# EAGLE design lpc2148 (EAGLE 9.4.1)
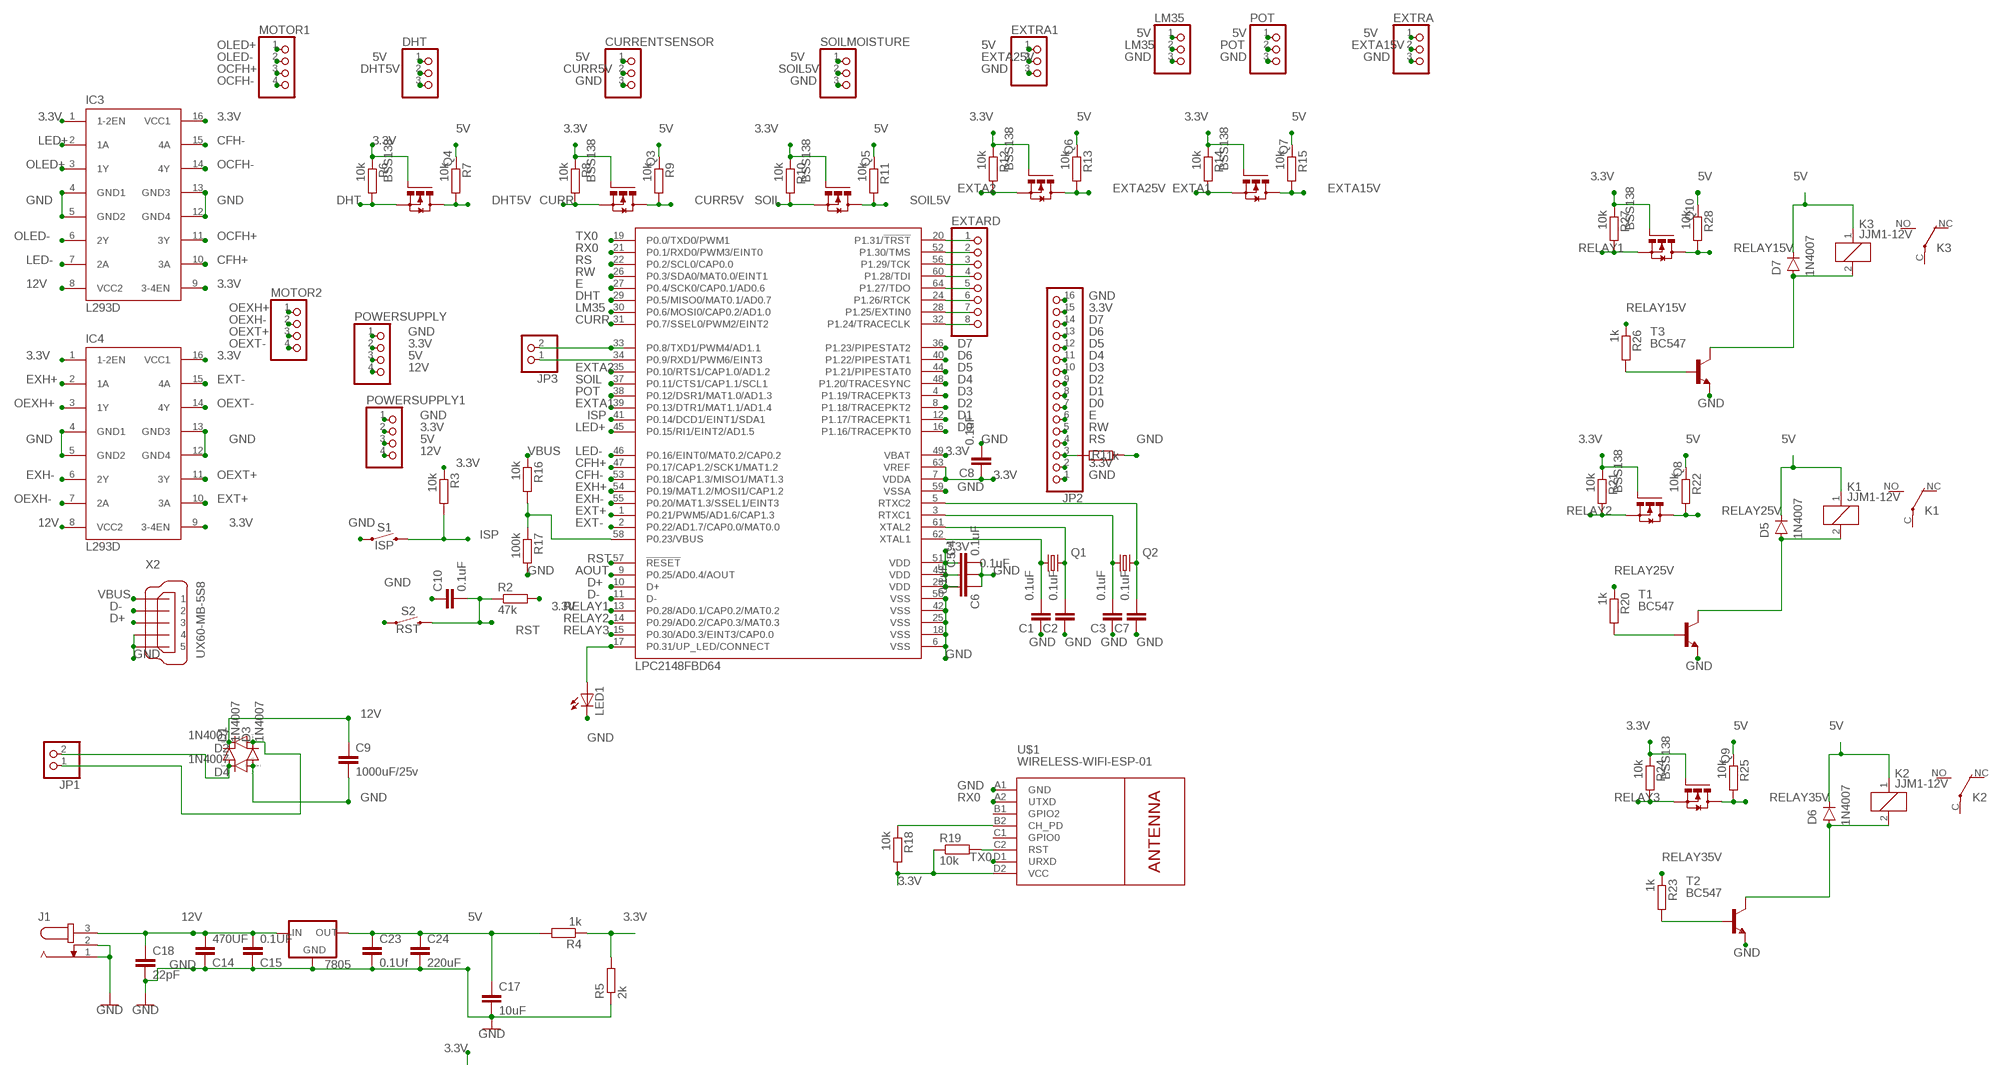
[diagram p0: schematic, sheet 1]

## Parts
7805  78XXL  [78XXL]
C1  0.1uF  10NF-0603-50V-10%  [0603]
C2  0.1uF  10NF-0603-50V-10%  [0603]
C3  0.1uF  10NF-0603-50V-10%  [0603]
C4  0.1uF  10NF-0603-50V-10%  [0603]
C5  0.1uF  10NF-0603-50V-10%  [0603]
C6  0.1uF  10NF-0603-50V-10%  [0603]
C7  0.1uF  10NF-0603-50V-10%  [0603]
C8  0.1uF  10NF-0603-50V-10%  [0603]
C9  1000uF/25v  22PF-0603-50V-5%  [0603]
C10  0.1uF  22PF-0603-50V-5%  [0603]
C14  470UF  22PF-0603-50V-5%  [0603]
C15  0.1UF  22PF-0603-50V-5%  [0603]
C17  10uF  22PF-0603-50V-5%  [0603]
C18  22pF  22PF-0603-50V-5%  [0603]
C23  0.1Uf  22PF-0603-50V-5%  [0603]
C24  220uF  22PF-0603-50V-5%  [0603]
CURRENTSENSOR  PINHD-1X3  [1X03]
D1  1N4007  1N4004  [DO41-10]
D2  1N4007  1N4004  [DO41-10]
D3  1N4007  1N4004  [DO41-10]
D4  1N4007  1N4004  [DO41-10]
D5  1N4007  [DO-41]
D6  1N4007  [DO-41]
D7  1N4007  [DO-41]
DHT  PINHD-1X3  [1X03]
EXTARD  PINHD-1X8-3.5MM  [1X08-3.5MM]
EXTRA  PINHD-1X3  [1X03]
EXTRA1  PINHD-1X3  [1X03]
IC3  L293D  [DIL16]
IC4  L293D  [DIL16]
J1  JACK-PLUG1  [SPC4078]
JP1  PINHD-1X2  [1X02]
JP2  PINHD-1X16  [1X16]
JP3  PINHD-1X2  [1X02]
K1  JJM1-12V  [JJM1C]
K2  JJM1-12V  [JJM1C]
K3  JJM1-12V  [JJM1C]
LED1  LED5MM  [LED5MM]
LM35  PINHD-1X3  [1X03]
MOTOR1  PINHD-1X4  [1X04]
MOTOR2  PINHD-1X4  [1X04]
POT  PINHD-1X3  [1X03]
POWERSUPPLY  PINHD-1X4  [1X04]
POWERSUPPLY1  PINHD-1X4  [1X04]
Q1  KX-12B  [6.0X3.5_2]
Q2  KX-12B  [6.0X3.5_2]
Q3  BSS138  [SOT23-3]
Q4  BSS138  [SOT23-3]
Q5  BSS138  [SOT23-3]
Q6  BSS138  [SOT23-3]
Q7  BSS138  [SOT23-3]
Q8  BSS138  [SOT23-3]
Q9  BSS138  [SOT23-3]
Q10  BSS138  [SOT23-3]
R1  1k  R-EU_0204/5  [0204/5]
R2  47k  R-EU_0204/5  [0204/5]
R3  10k  R-EU_0204/5  [0204/5]
R4  1k  R-EU_0204/5  [0204/5]
R5  2k  R-EU_0204/5  [0204/5]
R6  10k  R-EU_0204/5  [0204/5]
R7  10k  R-EU_0204/5  [0204/5]
R8  10k  R-EU_0204/5  [0204/5]
R9  10k  R-EU_0204/5  [0204/5]
R10  10k  R-EU_0204/5  [0204/5]
R11  10k  R-EU_0204/5  [0204/5]
R12  10k  R-EU_0204/5  [0204/5]
R13  10k  R-EU_0204/5  [0204/5]
R14  10k  R-EU_0204/5  [0204/5]
R15  10k  R-EU_0204/5  [0204/5]
R16  10k  R-EU_0204/5  [0204/5]
R17  100k  R-EU_0204/5  [0204/5]
R18  10k  R-EU_0204/5  [0204/5]
R19  10k  R-EU_0204/5  [0204/5]
R20  1k  R-EU_0204/5  [0204/5]
R21  10k  R-EU_0204/5  [0204/5]
R22  10k  R-EU_0204/5  [0204/5]
R23  1k  R-EU_0204/5  [0204/5]
R24  10k  R-EU_0204/5  [0204/5]
R25  10k  R-EU_0204/5  [0204/5]
R26  1k  R-EU_0204/5  [0204/5]
R27  10k  R-EU_0204/5  [0204/5]
R28  10k  R-EU_0204/5  [0204/5]
S1  ISP  MOMENTARY-SWITCH-SPST-PTH-6.0MM-KIT  [TACTILE_SWITCH_PTH_6.0MM_KIT]
S2  RST  MOMENTARY-SWITCH-SPST-PTH-6.0MM-KIT  [TACTILE_SWITCH_PTH_6.0MM_KIT]
SOILMOISTURE  PINHD-1X3  [1X03]
T1  BC547  [TO92]
T2  BC547  [TO92]
T3  BC547  [TO92]
U1  LPC2148FBD64  [TSQFP50P1200X1200X160-64N]
U$1  WIRELESS-WIFI-ESP-01  [WIRELESS-WIFI-ESP-01]
X2  UX60-MB-5S8  [UX60-MB-5S8]

## Nets
3.3V: C4.1 C5.1 C6.2 C8.1 IC3.1(1-2EN) IC3.9(3-4EN) IC3.16(VCC1) IC4.1(1-2EN) IC4.9(3-4EN) IC4.16(VCC1) JP2.2 JP2.15 POWERSUPPLY1.2 POWERSUPPLY.2 Q3.1(G) Q4.1(G) Q5.1(G) Q6.1(G) Q7.1(G) Q8.1(G) Q9.1(G) Q10.1(G) R2.2 R3.1 R4.1 R5.2 R6.1 R8.1 R10.1 R12.1 R14.1 R18.2 R19.1 R21.1 R24.1 R27.1 U1.7(VDDA) U1.23(VDD) U1.43(VDD) U1.49(VBAT) U1.51(VDD) U1.63(VREF) U$1.D2(VCC)
5V: 7805.OUT C17.1 C23.1 C24.1 CURRENTSENSOR.1 D5.C D6.C D7.C DHT.1 EXTRA1.1 EXTRA.1 K1.1 K2.1 K3.1 LM35.1 POT.1 POWERSUPPLY1.3 POWERSUPPLY.3 R4.2 R7.1 R9.1 R11.1 R13.1 R15.1 R22.1 R25.1 R28.1 SOILMOISTURE.1
12V: 7805.IN C9.1 C14.1 C15.1 C18.1 D1.C D2.C IC3.8(VCC2) IC4.8(VCC2) J1.3 POWERSUPPLY1.4 POWERSUPPLY.4
AOUT: U1.9(P0.25/AD0.4/AOUT)
CFH+: IC3.10(3A) U1.47(P0.17/CAP1.2/SCK1/MAT1.2)
CFH-: IC3.15(4A) U1.53(P0.18/CAP1.3/MISO1/MAT1.3)
CURR: Q3.2(S) R8.2 U1.31(P0.7/SSEL0/PWM2/EINT2)
CURR5V: CURRENTSENSOR.2 Q3.3(D) R9.2
D0: JP2.7 U1.16(P1.16/TRACEPKT0)
D1: JP2.8 U1.12(P1.17/TRACEPKT1)
D2: JP2.9 U1.8(P1.18/TRACEPKT2)
D3: JP2.10 U1.4(P1.19/TRACEPKT3)
D4: JP2.11 U1.48(P1.20/TRACESYNC)
D5: JP2.12 U1.44(P1.21/PIPESTAT0)
D6: JP2.13 U1.40(P1.22/PIPESTAT1)
D7: JP2.14 U1.36(P1.23/PIPESTAT2)
D+: U1.10(D+) X2.3
D-: U1.11(D-) X2.2
DHT: Q4.2(S) R6.2 U1.29(P0.5/MISO0/MAT0.1/AD0.7)
DHT5V: DHT.2 Q4.3(D) R7.2
E: JP2.6 U1.27(P0.4/SCK0/CAP0.1/AD0.6)
EXH+: IC4.2(1A) U1.54(P0.19/MAT1.2/MOSI1/CAP1.2)
EXH-: IC4.6(2Y) U1.55(P0.20/MAT1.3/SSEL1/EINT3)
EXT+: IC4.10(3A) U1.1(P0.21/PWM5/AD1.6/CAP1.3)
EXT-: IC4.15(4A) U1.2(P0.22/AD1.7/CAP0.0/MAT0.0)
EXTA1: Q7.2(S) R14.2 U1.39(P0.13/DTR1/MAT1.1/AD1.4)
EXTA2: Q6.2(S) R12.2 U1.35(P0.10/RTS1/CAP1.0/AD1.2)
EXTA15V: EXTRA.2 Q7.3(D) R15.2
EXTA25V: EXTRA1.2 Q6.3(D) R13.2
GND: 7805.GND C1.1 C2.1 C3.1 C4.2 C5.2 C6.1 C7.1 C8.2 C9.2 C10.1 C14.2 C15.2 C17.2 C18.2 C23.2 C24.2 CURRENTSENSOR.3 D3.A D4.A DHT.3 EXTRA1.3 EXTRA.3 IC3.4(GND1) IC3.5(GND2) IC3.12(GND4) IC3.13(GND3) IC4.4(GND1) IC4.5(GND2) IC4.12(GND4) IC4.13(GND3) J1.1 J1.2 JP2.1 JP2.16 LED1.K(C) LM35.3 POT.3 POWERSUPPLY1.1 POWERSUPPLY.1 R1.1 R5.1 R17.2 S1.1 SOILMOISTURE.3 T1.1(E) T2.1(E) T3.1(E) U1.6(VSS) U1.18(VSS) U1.25(VSS) U1.42(VSS) U1.50(VSS) U1.59(VSSA) U$1.A1(GND) X2.4 X2.5
ISP: R3.2 S1.3 U1.41(P0.14/DCD1/EINT1/SDA1)
LED+: IC3.2(1A) U1.45(P0.15/RI1/EINT2/AD1.5)
LED-: IC3.7(2A) U1.46(P0.16/EINT0/MAT0.2/CAP0.2)
LM35: LM35.2 U1.30(P0.6/MOSI0/CAP0.2/AD1.0)
N$1: C1.2 Q1.1 U1.62(XTAL1)
N$2: C2.2 Q1.2 U1.61(XTAL2)
N$3: C3.2 Q2.1 U1.3(RTXC1)
N$4: C7.2 Q2.2 U1.5(RTXC2)
N$5: D1.A D4.C JP1.2
N$6: D2.A D3.C JP1.1
N$7: JP3.2 U1.33(P0.8/TXD1/PWM4/AD1.1)
N$8: JP3.1 U1.34(P0.9/RXD1/PWM6/EINT3)
N$9: S2.1
N$10: D6.A K2.2 T2.3(C)
N$11: LED1.A U1.17(P0.31/UP_LED/CONNECT)
N$12: D5.A K1.2 T1.3(C)
N$13: R20.2 T1.2(B)
N$14: EXTARD.1 U1.20(P1.31/!TRST)
N$15: EXTARD.2 U1.52(P1.30/TMS)
N$16: EXTARD.3 U1.56(P1.29/TCK)
N$17: R16.2 R17.1 U1.58(P0.23/VBUS)
N$18: EXTARD.4 U1.60(P1.28/TDI)
N$19: EXTARD.5 U1.64(P1.27/TDO)
N$20: JP2.3 R1.2
N$21: R23.2 T2.2(B)
N$22: EXTARD.6 U1.24(P1.26/RTCK)
N$23: EXTARD.7 U1.28(P1.25/EXTIN0)
N$24: EXTARD.8 U1.32(P1.24/TRACECLK)
N$25: R18.1 U$1.B2(CH_PD)
N$26: R19.2 U$1.C2(RST)
N$27: D7.A K3.2 T3.3(C)
N$28: R26.2 T3.2(B)
OCFH+: IC3.11(3Y) MOTOR1.3
OCFH-: IC3.14(4Y) MOTOR1.4
OEXH+: IC4.3(1Y) MOTOR2.1
OEXH-: IC4.7(2A) MOTOR2.2
OEXT+: IC4.11(3Y) MOTOR2.3
OEXT-: IC4.14(4Y) MOTOR2.4
OLED+: IC3.3(1Y) MOTOR1.1
OLED-: IC3.6(2Y) MOTOR1.2
POT: POT.2 U1.38(P0.12/DSR1/MAT1.0/AD1.3)
RELAY1: Q10.2(S) R27.2 U1.13(P0.28/AD0.1/CAP0.2/MAT0.2)
RELAY2: Q8.2(S) R21.2 U1.14(P0.29/AD0.2/CAP0.3/MAT0.3)
RELAY3: Q9.2(S) R24.2 U1.15(P0.30/AD0.3/EINT3/CAP0.0)
RELAY15V: Q10.3(D) R26.1 R28.2
RELAY25V: Q8.3(D) R20.1 R22.2
RELAY35V: Q9.3(D) R23.1 R25.2
RS: JP2.4 U1.22(P0.2/SCL0/CAP0.0)
RST: C10.2 R2.1 S2.3 U1.57(!RESET)
RW: JP2.5 U1.26(P0.3/SDA0/MAT0.0/EINT1)
RX0: U1.21(P0.1/RXD0/PWM3/EINT0) U$1.A2(UTXD)
SOIL: Q5.2(S) R10.2 U1.37(P0.11/CTS1/CAP1.1/SCL1)
SOIL5V: Q5.3(D) R11.2 SOILMOISTURE.2
TX0: U1.19(P0.0/TXD0/PWM1) U$1.D1(URXD)
VBUS: R16.1 X2.1
Unconnected: K1.C(2:P) K1.NC(2:O) K1.NO(2:S) K2.C(2:P) K2.NC(2:O) K2.NO(2:S) K3.C(2:P) K3.NC(2:O) K3.NO(2:S) U$1.B1(GPIO2) U$1.C1(GPIO0) X2.S1 X2.S2 X2.S3 X2.S4

## Library data of the parts
7805 = v-reg:78XXL: VOLTAGE REGULATOR
C1-C8 = SparkFun-Capacitors:10NF: 0.01uF/10nF/10,000pF ceramic capacitors A capacitor is a passive two-terminal electrical component used to store electrical energy temporarily in an electric field. CAP-09321; PROD_ID: CAP-00867; VALUE: 10nF
C9 C10 C14 C15 C17 C23 C24 = SparkFun-Capacitors:22PF: 22pF ceramic capacitors A capacitor is a passive two-terminal electrical component used to store electrical energy temporarily in an electric field.; PROD_ID: CAP-07876; VALUE: 22pF
C18 = SparkFun-Capacitors:22PF: 22pF ceramic capacitors A capacitor is a passive two-terminal electrical component used to store electrical energy temporarily in an electric field.; PROD_ID: CAP-07876
CURRENTSENSOR DHT EXTRA EXTRA1 LM35 POT SOILMOISTURE = pinhead:PINHD-1X3: PIN HEADER
D1-D4 = diode:1N4004: DIODE general purpose rectifier, 1 A
D5-D7 = Diodes:1N4007: DIODE GEN PURP 1KV 1A DO41; CREATED_BY: PCB Layout; DIGIKEY_PART_NUMBER: 1N4007MSCT-ND; MANUFACTURER: Micro Commercial Co; MPN: 1N4007; PACKAGE: DO-41
EXTARD = adafruit:PINHD-1X8: PIN HEADER
IC3 IC4 = st-microelectronics:L293D: PUSH-PULL 4 CHANNEL DRIVER; MPN: L293D; OC_FARNELL: 9589619; OC_NEWARK: 56P8249
J1 = con-jack:JACK-PLUG: DC POWER JACK Power Jack, DC, Right Angle, Through Hole, Rated 5A at 16VDC, PC Terminals Distributor: Farnell (www.Farnell.de) Drawing: 84N1161.pdf / 84N1162.pdf Manufacturer: SPC Technology (www.spctechnology.com) Type: SPC4077 / SPC 4078; OC_FARNELL: unknown; OC_NEWARK: unknown
JP1 JP3 = pinhead:PINHD-1X2: PIN HEADER
JP2 = pinhead:PINHD-1X16: PIN HEADER
K1-K3 = relay:JJM1-12V: HALF-SIZE AUTOMOTIVE RELAY NAiS Source: http://www.mew-europe.com/.. en_ds_61210_0001.pdf; MF: AROMAT/ MATSUSHITA; MPN: JJM1-12V; OC_FARNELL: unknown; OC_NEWARK: 10C7318
LED1 = adafruit:LED: LED OSRAM: - CHIPLED LG R971, LG N971, LY N971, LG Q971, LY Q971, LO R971, LY R971 LH N974, LH R974 LS Q976, LO Q976, LY Q976 LO Q996 - Hyper CHIPLED LW Q18S LB Q993, LB Q99A, LB R99A - SideLED LS A670, LO A670, LY A670, LG A670, LP A670 LB A673, LV A673, LT A673, LW A673 LH A674 LY A675 LS A676, LA A676, LO A676, LY A676, LW A676 LS A679, LY A679, LG A679 - Hyper Micro SIDELED® LS Y876, LA Y876, LO Y876, LY Y876 LT Y87S - SmartLED LW L88C, LW L88S LB L89C, LB L89S, LG L890 LS L89K, LO L89K, LY L89K LS L896, LA L896, LO L896, LY L896 - TOPLED LS T670, LO T670, LY T670, LG T670, LP T670 LSG T670, LSP T670, LSY T670, LOP T670, LYG T670 LG T671, LOG T671, LSG T671 LB T673, LV T673, LT T673, LW T673 LH T674 LS T676, LA T676, LO T676, LY T676, LB T676, LH T676, LSB T676, LW T676 LB T67C, LV T67C, LT T67C, LS T67K, LO T67K, LY T67K, LW E67C LS E67B, LA E67B, LO E67B, LY E67B, LB E67C, LV E67C, LT E67C LW T67C LS T679, LY T679, LG T679 LS T770, LO T770, LY T770, LG T770, LP T770 LB T773, LV T773, LT T773, LW T773 LH T774 LS E675, LA E675, LY E675, LS T675 LS T776, LA T776, LO T776, LY T776, LB T776 LHGB T686 LT T68C, LB T68C - Hyper Mini TOPLED® LB M676 - Mini TOPLED Santana® LG M470 LS M47K, LO M47K, LY M47K Source: http://www.osram.convergy.de/
MOTOR1 MOTOR2 POWERSUPPLY POWERSUPPLY1 = pinhead:PINHD-1X4: PIN HEADER
Q1 Q2 = crystal-geyer_V1_0:KX: Quartz Crystals (MHz) SMD: KX - Serie Model Size l/w/h [mm] Frequency Range Frequency Stability Temp. Range [°C] Load Capacitance AECQ 200 availabel Datasheet KX-4 KX-5 KX-6 KX-7 KX-9A KX-9B KX-12A KX-12B KX-13 KX-20 KX-K KX-KS 1.6/1.2/0.3 2.0/1.6/0.45 2.5/2.0/0.55 3.2/2.5/0.8 5.0/3.2/1.0 5.0/3.2/1.1 6.0/3.5/1.1 6.0/3.5/1.0 7.0/5.0 /1.3 11.6/5.5/1.6 12.3/4.5/4.2 12.3/4.5/3.2 24.0 ~ 80.0 MHz 16.0 ~ 80.0 MHz 12.0 ~ 80.0 MHz 8.0 ~ 60.0 MHz 7,68 ~ 300,0 MHz 8,0 ~ 50,0 MHz 8,0 ~ 150,0 MHz 8,0 ~ 50,0 MHz 6,0 ~ 160,0 MHz 3,579 ~ 25,0 MHz 3,579 ~ 70,0 MHz 3,579 ~ 70,0 MHz ±10 … ±50ppm ±10 … ±50ppm ±10 … ±50ppm ±10 … ±50ppm ±10 … ±50ppm ±10 … ±50ppm ±10 … ±50ppm ±10 … ±50ppm ±10 … ±50ppm ±50ppm ±10 … ±50ppm ±10 … ±50ppm (*) -40°C …+85°C (*) -40°C …+125°C (*) -40°C …+125°C (*) -40°C …+125°C (*) -40°C …+105°C (*) -40°C …+105°C (*) -40°C …+125°C (*) -40°C …+105°C (*) -40°C …+105°C (*) -40°C …+105°C (*) -40°C …+85°C (*) -40°C …+85°C 8, 8…16 8, 8…16 10, 8…16 12, 7…20 16, 10…20 16, 10…20 16, 10…20 16, 12…20 16, 12…20 16, 12…20 16, 12…30 16, 12…30 - yes yes yes - - - - - - - - KX-4.pdf <http://www.geyer-electronic.de/uploads/tx_userartikelfrequenz/GEYER-KX-4.pdf> KX-5.pdf <http://www.geyer-electronic.de/uploads/tx_userartikelfrequenz/GEYER-KX-5.pdf> KX-6.pdf <http://www.geyer-electronic.de/uploads/tx_userartikelfrequenz/GEYER-KX-6.pdf> KX-7.pdf <http://www.geyer-electronic.de/uploads/tx_userartikelfrequenz/GEYER-KX-7.pdf> KX-9A.pdf <http://www.geyer-electronic.de/uploads/tx_userartikelfrequenz/GEYER-KX-9A.pdf> KX-9B.pdf <http://www.geyer-electronic.de/uploads/tx_userartikelfrequenz/GEYER-KX-9B.pdf> KX-12A.pdf <http://www.geyer-electronic.de/uploads/tx_userartikelfrequenz/GEYER-KX-12A.pdf> KX-12B.pdf <http://www.geyer-electronic.de/uploads/tx_userartikelfrequenz/GEYER-KX-12B.pdf> KX-13.pdf <http://www.geyer-electronic.de/uploads/tx_userartikelfrequenz/GEYER-KX-13.pdf> KX-20.pdf <http://www.geyer-electronic.de/uploads/tx_userartikelfrequenz/GEYER-KX-20.pdf> KX-K.pdf <http://www.geyer-electronic.de/uploads/tx_userartikelfrequenz/GEYER-KX-K.pdf> KX-KS.pdf <http://www.geyer-electronic.de/uploads/tx_userartikelfrequenz/GEYER-KX-KS.pdf> <http://www.geyer-electronic.de/fileadmin/template/img/logo-geyer-electronic.png> Details see: http://www.geyer-electronic.de/Frequenz-Produkte.9.0.html Created 2016-06-07, Hans Locher 2016 (C) Geyer Quartz Technology KX4,KX5,KX6,KX7,KX9A,KX9B,KX12A,KX12B,KX13,KX20,KXK,KXKS;1612;2016;2520;3225;5032;6035;7050;11655;12345;1,6x1,2;2,0x1,6;2,5x2,0;3,2x2,5;5,0x3,2;6,0x3,5;7,0x5,0;11,6x5,5;12,3x4,5;12,3x4,5;1.6x1.2;2.0x1.6;2.5x2.0;3.2x2.5;5.0x3.2;6.0x3.5;7.0x5.0;11.6x5.5;12.3x4.5;12.3x4.5;
Q3-Q10 = Transistor:BSS138: MOSFET N-CH 50V 220MA SOT-23; CREATED_BY: PCB Layout; DIGIKEY_PART_NUMBER: BSS138CT-ND; MANUFACTURER: ON Semiconductor; MPN: BSS138; PACKAGE: SOT-23
R1-R28 = resistor:R-EU_: RESISTOR, European symbol
S1 S2 = SparkFun-Switches:MOMENTARY-SWITCH-SPST: Momentary Switch (Pushbutton) - SPST Normally-open (NO) SPST momentary switches (buttons, pushbuttons). Variants PTH-12MM - 12mm square, through-hole Momentary Pushbutton Switch - 12mm Square <https://www.sparkfun.com/products/9190> (COM-09190) PTH-6.0MM, PTH-6.0MM-KIT - 6.0mm square, through-hole Mini Pushbutton Switch <https://www.sparkfun.com/products/97> (COM-00097) KIT package intended for soldering kit's - only one side of pads' copper is exposed. PTH-RIGHT-ANGLE-KIT - Right-angle, through-hole Right Angle Tactile Button <https://www.sparkfun.com/products/10791> - Used on SparkFun BigTime Watch Kit <https://www.sparkfun.com/products/11734> SMD-12MM - 12mm square, surface-mount Tactile Button - SMD (12mm) <https://www.sparkfun.com/products/12993> (COM-12993) Used on SparkFun PicoBoard <https://www.sparkfun.com/products/11888> SMD-4.5MM - 4.5mm Square Trackball Switch Used on SparkFun Blackberry Trackballer Breakout <https://www.sparkfun.com/products/13169> SMD-4.6MMX2.8MM - 4.60mm x 2.80mm, surface mount Used on SparkFun SAMD21 Mini Breakout <https://www.sparkfun.com/products/13664> SMD-5.2MM, SMD-5.2-REDUNDANT - 5.2mm square, surface-mount Mini Pushbutton Switch - SMD <https://www.sparkfun.com/products/8720> (COM-08720) Used on Arduino Pro Mini <https://www.sparkfun.com/products/11114> REDUNDANT package connects both switch circuits together SMD-6.0X3.5MM - 6.0 x 3.5mm, surface mount Momentary Reset Switch SMD <https://www.sparkfun.com/products/8229> (COM-08229) SMD-6.2MM-TALL - 6.2mm square, surface mount Tactile Button - SMD (6mm) <https://www.sparkfun.com/products/12992> Used on SparkFun Digital Sandbox <https://www.sparkfun.com/products/12651> SMD-RIGHT-ANGLE - Right-angle, surface mount Used on SparkFun Block for Intel® Edison - Arduino <https://www.sparkfun.com/products/13036>; PROD_ID: SWCH-08441; SF_SKU: COM-00097
T1-T3 = transistor:BC547: NPN TRANSISTOR
U1 = philips-5:LPC2148
U$1 = diy-modules:WIRELESS-WIFI-ESP-01: Wireless Wi-Fi ESP-01 Module based on ESP8266 chip Click here to find device on ebay.com <http://www.ebay.com/sch/esp8266+esp+01+transceiver>
X2 = ux60-mb-5s8-oshpark_10:UX60-MB-5S8: MINI USB Connector HI-SPEED Certified Metal Shield Dip Type With Positioning Post Source: http://www.hirose.co.jp/cataloge_hp/e24000019.pdf; MF: Hirose; MPN: UX60-MB-5S8; OC_FARNELL: unknown; OC_NEWARK: unknown

## Net classes
0 default: width 0.254 mm, drill 0.305 mm, clearance 0.254 mm

## Board
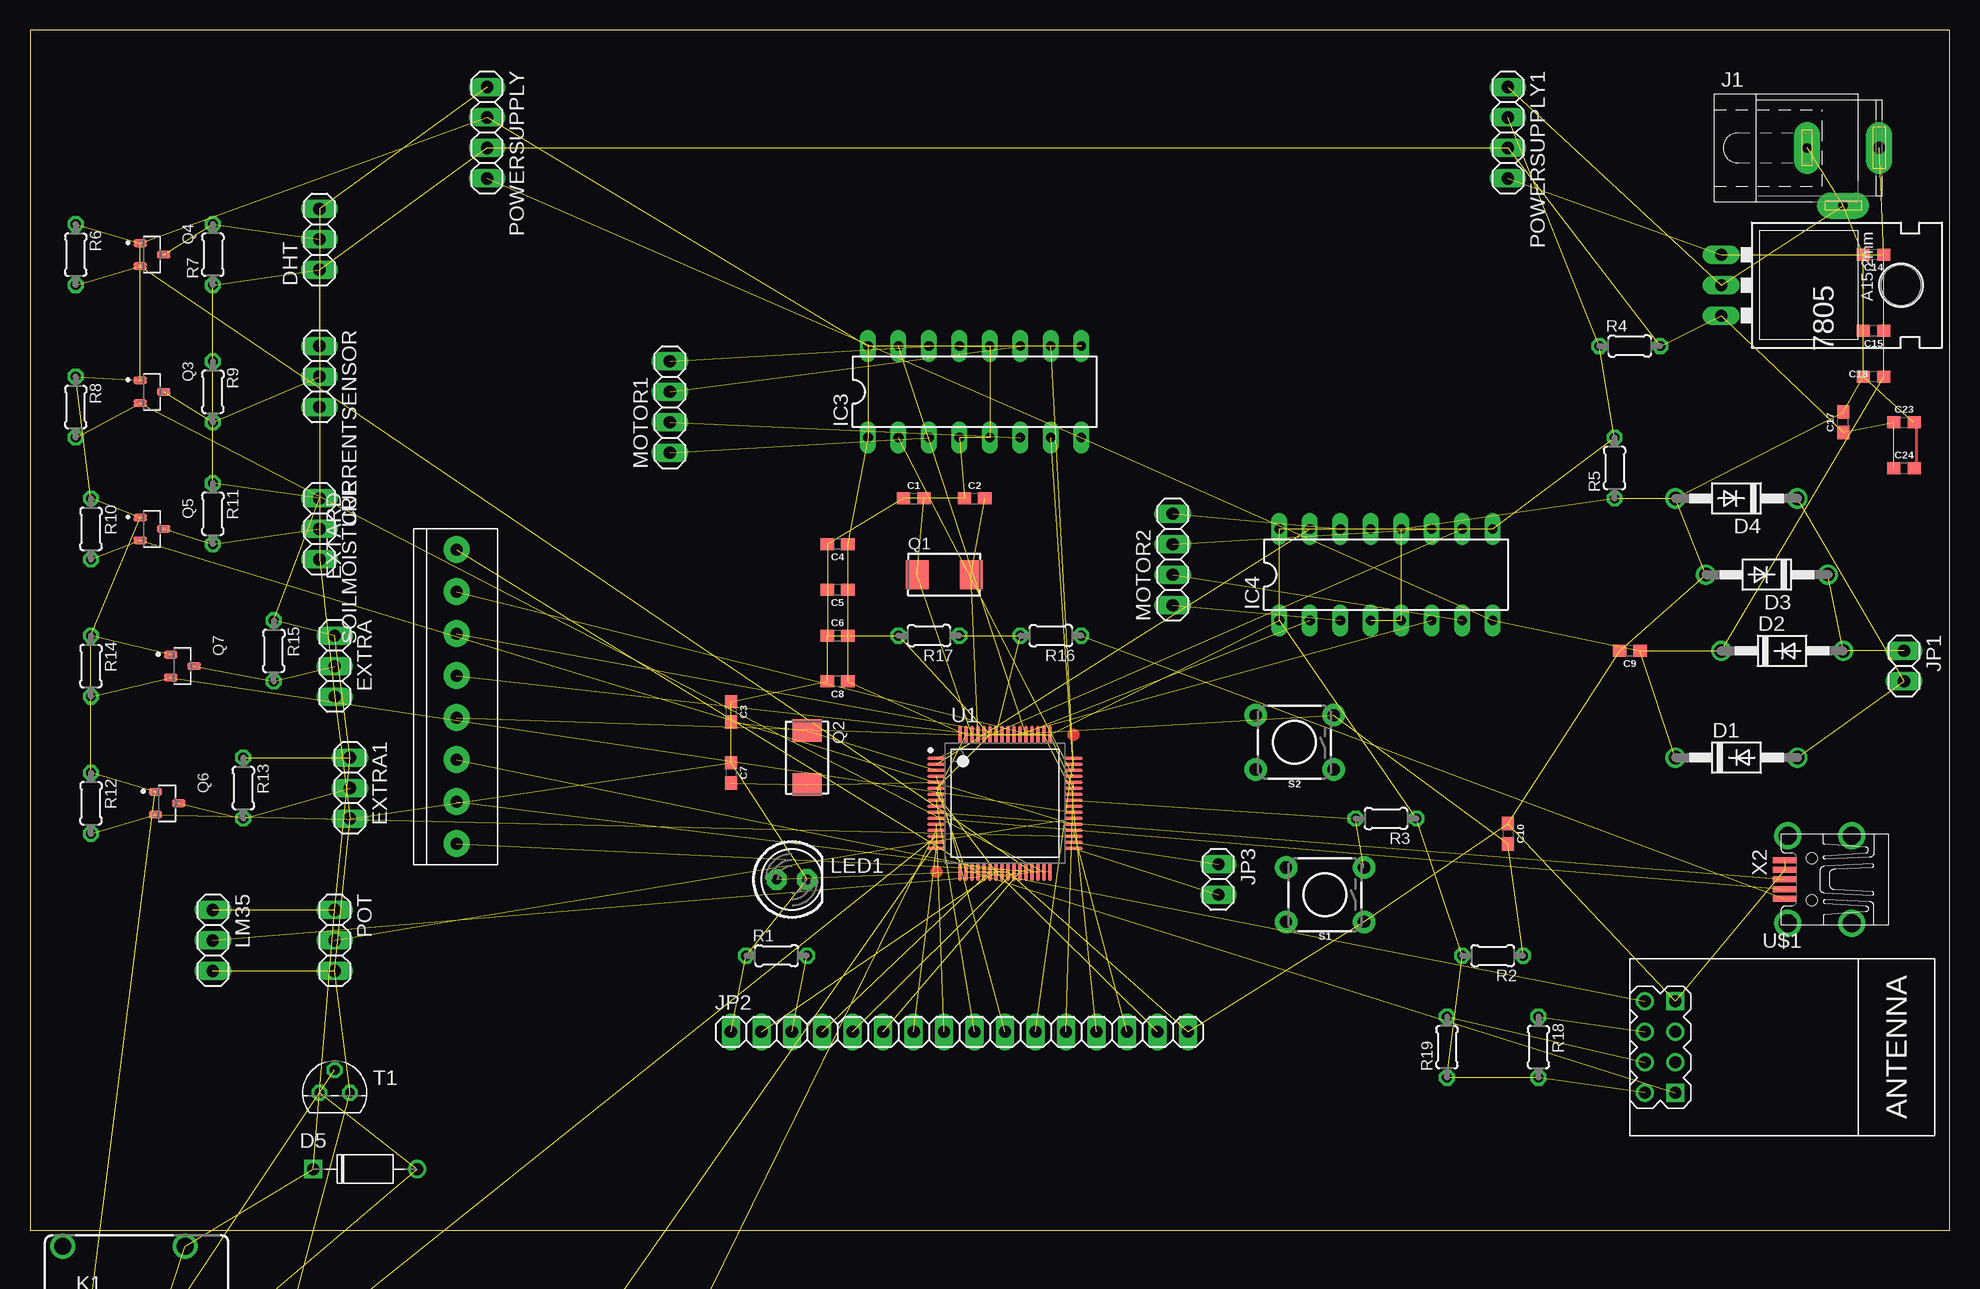
[diagram p1: board, top side]

Size 160 x 100 mm. Coordinates in mm from the lower left corner, seen from the top.
Outline: 0,0 160,0 160,100 0,100 0,0
Copper layers (1*16): Top 0.035mm / dielectric 1.5mm / Bottom 0.035mm
Design rules "default": minimum track width 6mil, minimum drill 0.35mm, track to track 6mil, track to pad 6mil, pad to pad 6mil, via to via 6mil, smd to smd 6mil, copper to edge 40mil, drill to drill 6mil, minimum pad ring 10mil, minimum via ring 8mil, stop-mask expansion 4mil, vias tented up to drill 0mil, thermal gap 10mil

### Footprints (pad centres in the part's own frame; a part is rotated, then mirrored left to right if it is on the bottom)
78XXL = drill 1.016 long: GND 0,-3.81; IN -2.54,-3.81; OUT 2.54,-3.81 | hole 3.302: 0,11.176
0603 = smd 1.1 x 1: 1 -0.85,0; 2 0.85,0
1X03 = drill 1.016 long: 1 -2.54,0; 2 0,0; 3 2.54,0
DO41-10 = drill 1.118: A 5.08,0; C -5.08,0
DO-41 = drill 1: A 4.325,0 | drill 1 square: C -4.325,0
1X08-3.5MM = drill 1 pad 2.184: 1 -12.25,0; 2 -8.75,0; 3 -5.25,0; 4 -1.75,0; 5 1.75,0; 6 5.25,0; 7 8.75,0; 8 12.25,0
DIL16 = drill 0.813 long: 1 -8.89,-3.81; 2 -6.35,-3.81; 3 -3.81,-3.81; 4 -1.27,-3.81; 5 1.27,-3.81; 6 3.81,-3.81; 7 6.35,-3.81; 8 8.89,-3.81; 9 8.89,3.81; 10 6.35,3.81; 11 3.81,3.81; 12 1.27,3.81; 13 -1.27,3.81; 14 -3.81,3.81; 15 -6.35,3.81; 16 -8.89,3.81
SPC4078 = drill 0.8 pad 2.184 long: 1 -3,0; 2 0,-4.8 | drill 1 pad 2.184 long: 3 3,0
1X02 = drill 1.016 long: 1 -1.27,0; 2 1.27,0
1X16 = drill 1.016 long: 1 -19.05,0; 2 -16.51,0; 3 -13.97,0; 4 -11.43,0; 5 -8.89,0; 6 -6.35,0; 7 -3.81,0; 8 -1.27,0; 9 1.27,0; 10 3.81,0; 11 6.35,0; 12 8.89,0; 13 11.43,0; 14 13.97,0; 15 16.51,0; 16 19.05,0
JJM1C = drill 1.4: 1 4.05,5; 2 4.05,-5; NC -6.15,-5; NO -6.15,5 | drill 1.5: C 6.55,0
LED5MM = drill 0.813 pad 1.676 octagon: A -1.27,0; K 1.27,0
1X04 = drill 1.016 long: 1 -3.81,0; 2 -1.27,0; 3 1.27,0; 4 3.81,0
6.0X3.5_2 = smd 1.9 x 2.4: 1 -2.25,0; 2 2.25,0
SOT23-3 = smd 0.62 x 1.1: 1 -0.95,-0.975; 2 0.95,-0.975; 3 0,0.975
0204/5 = drill 0.813 octagon: 1 -2.54,0; 2 2.54,0
TACTILE_SWITCH_PTH_6.0MM_KIT = drill 1.016 pad 1.88: 1 -3.251,2.261; 2 3.251,2.261; 3 -3.251,-2.261; 4 3.251,-2.261
TO92 = drill 0.813 octagon: 1 1.27,0; 2 0,1.905; 3 -1.27,0
TSQFP50P1200X1200X160-64N = smd 1.55 x 0.3: 1 -5.7,3.75; 2 -5.7,3.25; 3 -5.7,2.75; 4 -5.7,2.25; 5 -5.7,1.75; 6 -5.7,1.25; 7 -5.7,0.75; 8 -5.7,0.25; 9 -5.7,-0.25; 10 -5.7,-0.75; 11 -5.7,-1.25; 12 -5.7,-1.75; 13 -5.7,-2.25; 14 -5.7,-2.75; 15 -5.7,-3.25; 16 -5.7,-3.75; 33 5.7,-3.75; 34 5.7,-3.25; 35 5.7,-2.75; 36 5.7,-2.25; 37 5.7,-1.75; 38 5.7,-1.25; 39 5.7,-0.75; 40 5.7,-0.25; 41 5.7,0.25; 42 5.7,0.75; 43 5.7,1.25; 44 5.7,1.75; 45 5.7,2.25; 46 5.7,2.75; 47 5.7,3.25; 48 5.7,3.75 | smd 0.3 x 1.55: 17 -3.75,-5.7; 18 -3.25,-5.7; 19 -2.75,-5.7; 20 -2.25,-5.7; 21 -1.75,-5.7; 22 -1.25,-5.7; 23 -0.75,-5.7; 24 -0.25,-5.7; 25 0.25,-5.7; 26 0.75,-5.7; 27 1.25,-5.7; 28 1.75,-5.7; 29 2.25,-5.7; 30 2.75,-5.7; 31 3.25,-5.7; 32 3.75,-5.7; 49 3.75,5.7; 50 3.25,5.7; 51 2.75,5.7; 52 2.25,5.7; 53 1.75,5.7; 54 1.25,5.7; 55 0.75,5.7; 56 0.25,5.7; 57 -0.25,5.7; 58 -0.75,5.7; 59 -1.25,5.7; 60 -1.75,5.7; 61 -2.25,5.7; 62 -2.75,5.7; 63 -3.25,5.7; 64 -3.75,5.7
WIRELESS-WIFI-ESP-01 = drill 1 square: A1 -8.89,3.81; D1 -8.89,-3.81 | drill 1: A2 -11.43,3.81; B1 -8.89,1.27; B2 -11.43,1.27; C1 -8.89,-1.27; C2 -11.43,-1.27; D2 -11.43,-3.81
UX60-MB-5S8 = smd 2 x 0.5: 1 8.65,1.6; 2 8.65,0.8; 3 8.65,0; 4 8.65,-0.8; 5 8.65,-1.6 | drill 1.5: S1 3.1,-3.65; S2 3.1,3.65; S3 8.4,3.65; S4 8.4,-3.65 | hole 0.9: 6.4,-1.75; 6.4,1.75

### Placement (x,y rotation side)
7805  144.78,78.74 270 top
C1  73.66,60.96 0 top
C2  78.74,60.96 0 top
C3  58.42,43.18 270 top
C4  67.31,57.15 180 top
C5  67.31,53.34 180 top
C6  67.31,49.53 0 top
C7  58.42,38.1 270 top
C8  67.31,45.72 180 top
C9  133.35,48.26 180 top
C10  123.19,33.02 270 top
C14  153.67,81.28 180 top
C15  153.67,74.93 180 top
C17  151.13,67.31 90 top
C18  153.67,71.12 180 top
C23  156.21,67.31 0 top
C24  156.21,63.5 0 top
CURRENTSENSOR  24.13,71.12 270 top
D1  142.24,39.37 0 top
D2  146.05,48.26 0 top
D3  144.78,54.61 180 top
D4  142.24,60.96 180 top
D5  27.94,5.08 0 top
D6  6.35,-57.15 0 top  (outside the outline)
D7  6.35,-88.9 0 top  (outside the outline)
DHT  24.13,82.55 90 top
EXTARD  35.56,44.45 270 top
EXTRA  25.4,46.99 270 top
EXTRA1  26.67,36.83 270 top
IC3  78.74,69.85 0 top
IC4  113.03,54.61 0 top
J1  151.13,90.17 0 top
JP1  156.21,46.99 270 top
JP2  77.47,16.51 0 top
JP3  99.06,29.21 270 top
K1  8.89,-6.35 0 top
K2  8.89,-46.99 0 top  (outside the outline)
K3  8.89,-78.74 0 top  (outside the outline)
LED1  63.5,29.21 0 top
LM35  15.24,24.13 270 top
MOTOR1  53.34,68.58 90 top
MOTOR2  95.25,55.88 90 top
POT  25.4,24.13 270 top
POWERSUPPLY  38.1,91.44 270 top
POWERSUPPLY1  123.19,91.44 270 top
Q1  76.2,54.61 0 top
Q2  64.77,39.37 270 top
Q3  10.16,69.85 270 top
Q4  10.16,81.28 270 top
Q5  10.16,58.42 270 top
Q6  11.43,35.56 270 top
Q7  12.7,46.99 270 top
Q8  3.81,-22.86 0 top  (outside the outline)
Q9  20.32,-44.45 0 top  (outside the outline)
Q10  20.32,-76.2 0 top  (outside the outline)
R1  62.23,22.86 0 top
R2  121.92,22.86 180 top
R3  113.03,34.29 180 top
R4  133.35,73.66 0 top
R5  132.08,63.5 90 top
R6  3.81,81.28 270 top
R7  15.24,81.28 90 top
R8  3.81,68.58 270 top
R9  15.24,69.85 270 top
R10  5.08,58.42 270 top
R11  15.24,59.69 270 top
R12  5.08,35.56 270 top
R13  17.78,36.83 270 top
R14  5.08,46.99 270 top
R15  20.32,48.26 270 top
R16  85.09,49.53 180 top
R17  74.93,49.53 180 top
R18  125.73,15.24 270 top
R19  118.11,15.24 90 top
R20  3.81,-15.24 0 top  (outside the outline)
R21  3.81,-30.48 0 top  (outside the outline)
R22  3.81,-36.83 0 top  (outside the outline)
R23  15.24,-55.88 0 top  (outside the outline)
R24  3.81,-63.5 0 top  (outside the outline)
R25  11.43,-63.5 0 top  (outside the outline)
R26  15.24,-87.63 0 top  (outside the outline)
R27  3.81,-95.25 0 top  (outside the outline)
R28  11.43,-95.25 0 top  (outside the outline)
S1  107.95,27.94 180 top
S2  105.41,40.64 180 top
SOILMOISTURE  24.13,58.42 270 top
T1  25.4,11.43 0 top
T2  3.81,-69.85 0 top  (outside the outline)
T3  3.81,-101.6 0 top  (outside the outline)
U1  81.28,35.56 0 top
U$1  146.05,15.24 0 top
X2  154.94,29.21 180 top

### Tracks (layer width: path | path; a pad name or v marks a point on that pad's centre or on a via)
3.3V  (42 unrouted)
5V  (27 unrouted)
12V  (11 unrouted)
CFH+  (1 unrouted)
CFH-  (1 unrouted)
CURR  (2 unrouted)
CURR5V  (2 unrouted)
D0  (1 unrouted)
D1  (1 unrouted)
D2  (1 unrouted)
D3  (1 unrouted)
D4  (1 unrouted)
D5  (1 unrouted)
D6  (1 unrouted)
D7  (1 unrouted)
D+  (1 unrouted)
D-  (1 unrouted)
DHT  (2 unrouted)
DHT5V  (2 unrouted)
E  (1 unrouted)
EXH+  (1 unrouted)
EXH-  (1 unrouted)
EXT+  (1 unrouted)
EXT-  (1 unrouted)
EXTA1  (2 unrouted)
EXTA2  (2 unrouted)
EXTA15V  (2 unrouted)
EXTA25V  (2 unrouted)
GND  (55 unrouted)
  Top 0.254: C24.2 157.23,63.5 157.23,67.31 C23.2 156.97,67.31
ISP  (2 unrouted)
LED+  (1 unrouted)
LED-  (1 unrouted)
LM35  (1 unrouted)
N$1  (2 unrouted)
N$2  (2 unrouted)
N$3  (2 unrouted)
N$4  (2 unrouted)
N$5  (2 unrouted)
N$6  (2 unrouted)
N$7  (1 unrouted)
N$8  (1 unrouted)
N$10  (2 unrouted)
N$11  (1 unrouted)
N$12  (2 unrouted)
N$13  (1 unrouted)
N$14  (1 unrouted)
N$15  (1 unrouted)
N$16  (1 unrouted)
N$17  (2 unrouted)
N$18  (1 unrouted)
N$19  (1 unrouted)
N$20  (1 unrouted)
N$21  (1 unrouted)
N$22  (1 unrouted)
N$23  (1 unrouted)
N$24  (1 unrouted)
N$25  (1 unrouted)
N$26  (1 unrouted)
N$27  (2 unrouted)
N$28  (1 unrouted)
OCFH+  (1 unrouted)
OCFH-  (1 unrouted)
OEXH+  (1 unrouted)
OEXH-  (1 unrouted)
OEXT+  (1 unrouted)
OEXT-  (1 unrouted)
OLED+  (1 unrouted)
OLED-  (1 unrouted)
POT  (1 unrouted)
RELAY1  (2 unrouted)
RELAY2  (2 unrouted)
RELAY3  (2 unrouted)
RELAY15V  (2 unrouted)
RELAY25V  (2 unrouted)
RELAY35V  (2 unrouted)
RS  (1 unrouted)
RST  (3 unrouted)
RW  (1 unrouted)
RX0  (1 unrouted)
SOIL  (2 unrouted)
SOIL5V  (2 unrouted)
TX0  (1 unrouted)
VBUS  (1 unrouted)